# EAGLE design Processor Board (EAGLE 7.5.0)
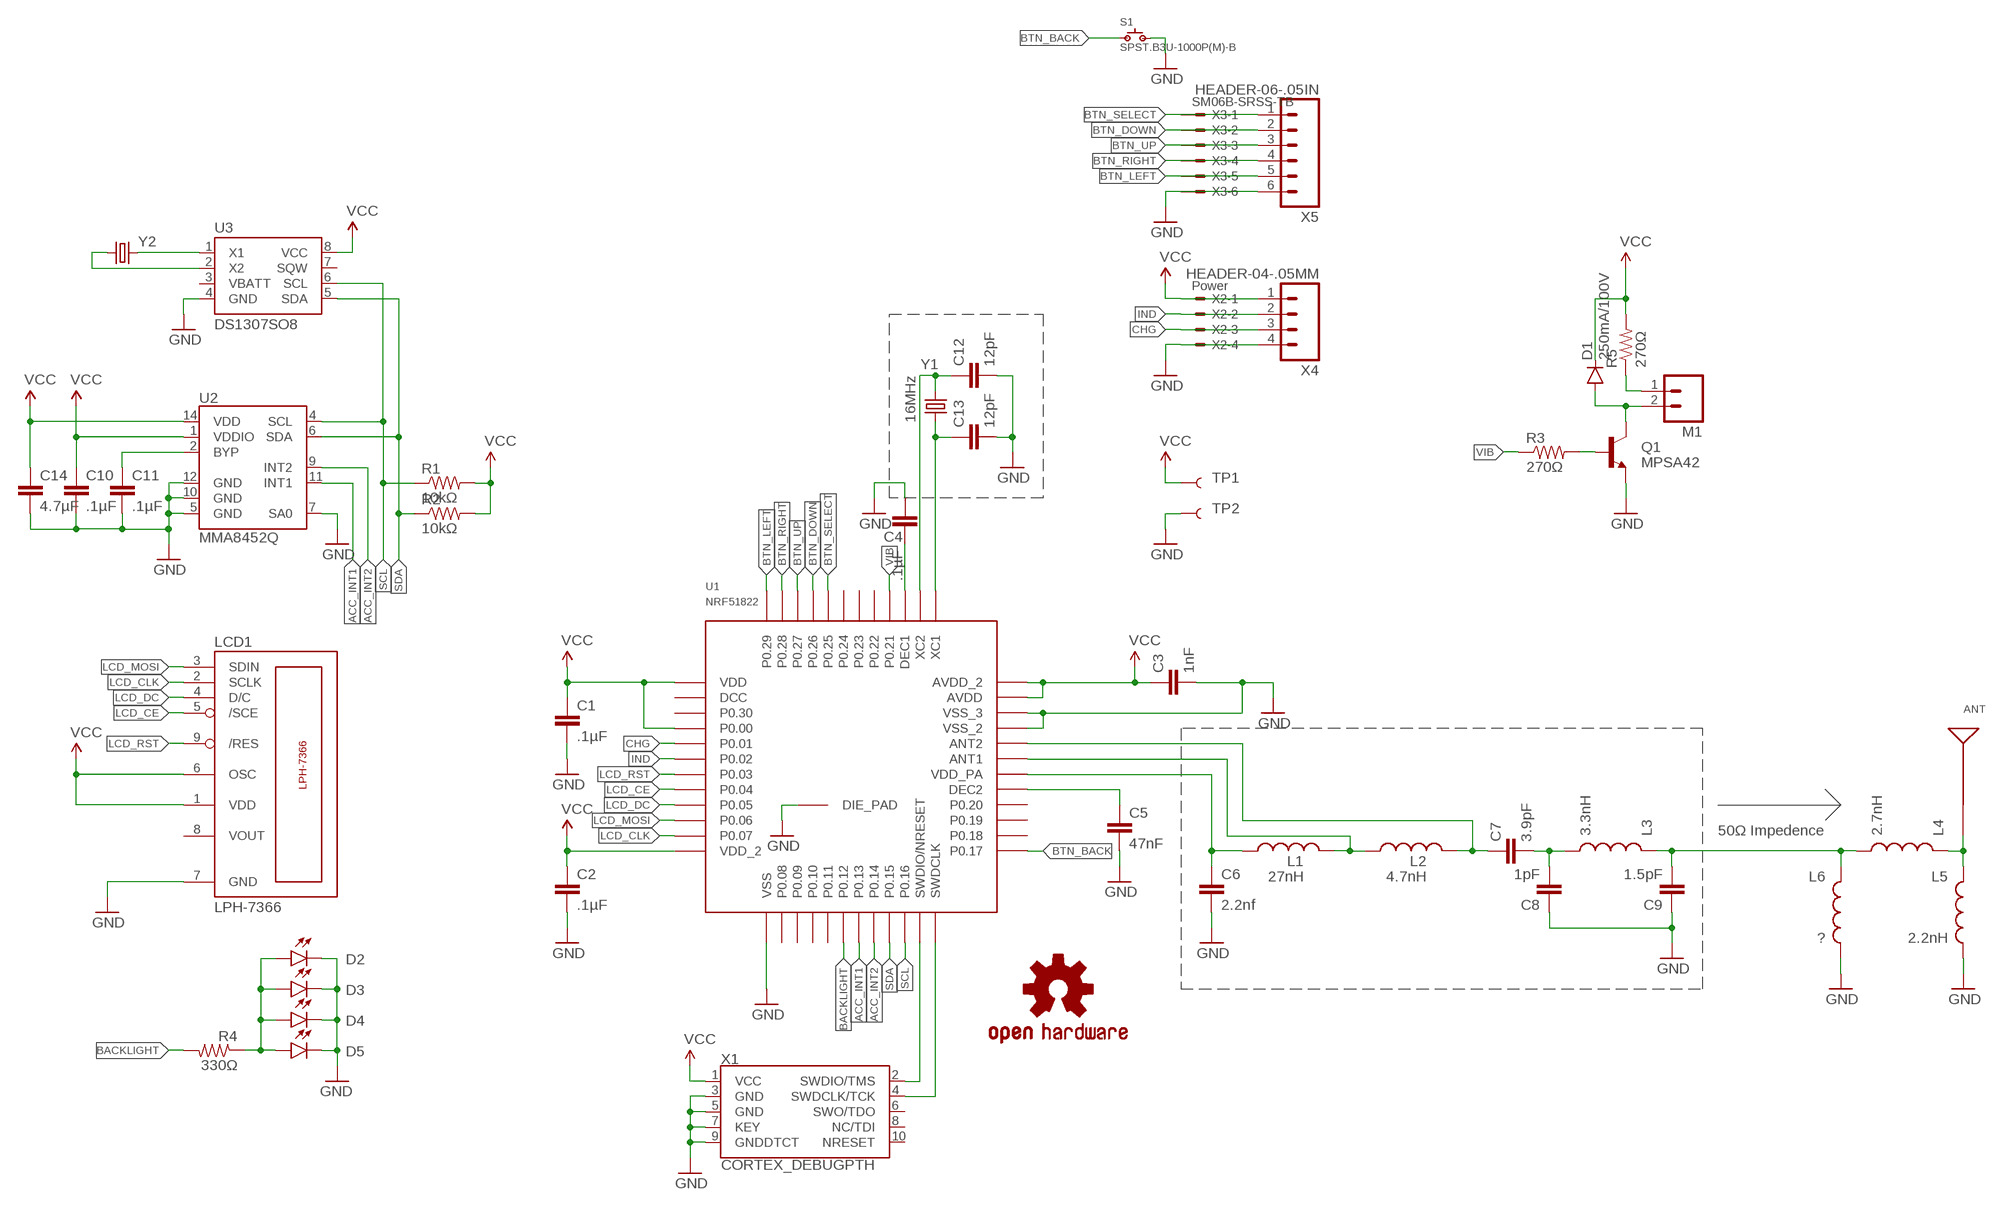
[diagram p0: schematic, sheet 1]

## Parts
ANT  ANTENNA_CHIP2450AT43B100  [AT43B]
C1  .1µF  CAP0805  [0805]
C2  .1µF  CAP0805  [0805]
C3  1nF  CAP0805  [0805]
C4  .1µF  CAP0805  [0805]
C5  47nF  CAP0805  [0805]
C6  2.2nf  CAP0805  [0805]
C7  3.9pF  CAP0805  [0805]
C8  1pF  CAP0805  [0805]
C9  1.5pF  CAP0805  [0805]
C10  .1µF  CAP0805  [0805]
C11  .1µF  CAP0805  [0805]
C12  12pF  CAP0805  [0805]
C13  12pF  CAP0805  [0805]
C14  4.7µF  CAP0805  [0805]
D1  250mA/100V  DIODEBAS16  [SOD-323]
D2  LED1206  [LED-1206]
D3  LED1206  [LED-1206]
D4  LED1206  [LED-1206]
D5  LED1206  [LED-1206]
L1  27nH  INDUCTOR0805  [0805]
L2  4.7nH  INDUCTOR0805  [0805]
L3  3.3nH  INDUCTOR0805  [0805]
L4  2.7nH  INDUCTOR0805  [0805]
L5  2.2nH  INDUCTOR0805  [0805]
L6  ?  INDUCTOR0805  [0805]
LCD1  LPH-7366  [LPH-7366]
LOGO1  OSHW-LOGOL-COPPER  [OSHW-LOGO-L_COPPER]
M1  M021X02_NO_SILK  [1X02_NO_SILK]
Q1  MPSA42  TRANSISTOR_NPNMPSA42  [SOT23-3]
R1  10kΩ  RESISTOR0805-RES  [0805]
R2  10kΩ  RESISTOR0805-RES  [0805]
R3  270Ω  RESISTOR0805-RES  [0805]
R4  330Ω  RESISTOR0805-RES  [0805]
R5  270Ω  RESISTOR0805-RES  [0805]
S1  SPST.B3U-1000P(M)-B  [B3U-1000P(M)-B]
TP1  TEST-POINT3  [PAD.03X.03]
TP2  TEST-POINT3  [PAD.03X.03]
U1  NRF51822  [QFN48]
U2  MMA8452Q  [QFN-16_0.5MM]
U3  DS1307SO8  [SO08]
X1  CORTEX_DEBUGPTH  [2X5-PTH-1.27MM]
X2  Power  SM04B-SRSS-TB  [SM04B-SRSS-TB]
X3  SM06B-SRSS-TB  [SM06B-SRSS-TB]
X4  HEADER-04-.05MM  [HEADER-04-.05IN]
X5  HEADER-06-.05IN  [HEADER-06-.05IN]
Y1  16MHz  CRYSTALCRYSTAL-SMD-5X3-16MHZ  [CRYSTAL-SMD-5X3]
Y2  CRYSTAL32-SMD-MELF  [CRYSTAL-32KHZ-SMD-MELF]

## Nets
ACC_INT1: U1.19(P0.13) U2.11(INT1)
ACC_INT2: U1.20(P0.14) U2.9(INT2)
ANT: ANT.ANT L4.1 L5.1
ANT1: L1.1 L2.2 U1.31(ANT1)
ANT2: C7.1 L2.1 U1.32(ANT2)
BACKLIGHT: R4.2 U1.18(P0.12)
BTN_BACK: S1.1 U1.25(P0.17)
BTN_DOWN: U1.45(P0.26) X3.2 X5.2
BTN_LEFT: U1.48(P0.29) X3.5 X5.5
BTN_RIGHT: U1.47(P0.28) X3.4 X5.4
BTN_SELECT: U1.44(P0.25) X3.1 X5.1
BTN_UP: U1.46(P0.27) X3.3 X5.3
CHG: U1.5(P0.01) X2.3 X4.3
F_1: C7.2 C8.2 L3.2
F_2: C9.2 L3.1 L4.2 L6.1
GND: C1.2 C2.2 C3.2 C4.1 C5.2 C6.2 C8.1 C9.1 C10.2 C11.2 C12.1 C13.1 C14.2 D2.C D3.C D4.C D5.C L5.2 L6.2 LCD1.7(GND) Q1.2(E) S1.2 TP2.P$1 U1.13(VSS) U1.33(VSS_2) U1.34(VSS_3) U1.GND(DIE_PAD) U2.5(GND) U2.7(SA0) U2.10(GND) U2.12(GND) U3.4(GND) X1.3(GND) X1.5(GND) X1.7(KEY) X1.9(GNDDTCT) X2.4 X3.6 X4.4 X5.6
IND: U1.6(P0.02) X2.2 X4.2
LCD_CE: LCD1.5(/SCE) U1.8(P0.04)
LCD_CLK: LCD1.2(SCLK) U1.11(P0.07)
LCD_DC: LCD1.4(D/C) U1.9(P0.05)
LCD_MOSI: LCD1.3(SDIN) U1.10(P0.06)
LCD_RST: LCD1.9(/RES) U1.7(P0.03)
N$1: U1.24(SWDCLK) X1.4(SWDCLK/TCK)
N$2: C4.2 U1.39(DEC1)
N$3: U1.23(SWDIO/NRESET) X1.2(SWDIO/TMS)
N$4: C5.1 U1.29(DEC2)
N$6: C11.1 U2.2(BYP)
N$10: Q1.1(B) R3.2
N$11: C12.2 U1.38(XC2) Y1.3
N$12: C13.2 U1.37(XC1) Y1.1
N$13: U3.1(X1) Y2.X2
N$14: D1.A M1.2 Q1.3(C)
N$15: M1.1 R5.1
N$16: U3.2(X2) Y2.X1
N$17: D2.A D3.A D4.A D5.A R4.1
SCL: R1.1 U1.22(P0.16) U2.4(SCL) U3.6(SCL)
SDA: R2.1 U1.21(P0.15) U2.6(SDA) U3.5(SDA)
VCC: C1.1 C2.1 C3.1 C10.1 C14.1 D1.C LCD1.1(VDD) LCD1.6(OSC) R1.2 R2.2 R5.2 TP1.P$1 U1.1(VDD) U1.4(P0.00) U1.12(VDD_2) U1.35(AVDD) U1.36(AVDD_2) U2.1(VDDIO) U2.14(VDD) U3.8(VCC) X1.1(VCC) X2.1 X4.1
VDD_PA: C6.1 L1.2 U1.30(VDD_PA)
VIB: R3.1 U1.40(P0.21)
Unconnected: LCD1.8(VOUT) U1.2(DCC) U1.3(P0.30) U1.14(P0.08) U1.15(P0.09) U1.16(P0.10) U1.17(P0.11) U1.26(P0.18) U1.27(P0.19) U1.28(P0.20) U1.41(P0.22) U1.42(P0.23) U1.43(P0.24) U3.3(VBATT) U3.7(SQW) X1.6(SWO/TDO) X1.8(NC/TDI) X1.10(NRESET)

## Notes on the sheet
- 50Ω Impedence

## Library data of the parts
ANT = _Antennas:ANTENNA_CHIP; DIGIKEY: 712-1010-1-ND; MANUFACTURER: Johanson Technology
C1-C14 = SparkFun-Passives:CAP: Capacitor Standard 0603 ceramic capacitor, and 0.1" leaded capacitor.
D1 = SparkFun-DiscreteSemi:DIODE: Diode These are standard reverse protection diodes and small signal diodes. SMA package can handle up to about 1A. SOD-323 can handle about 200mA. What the SOD-323 package when ordering, there are some mfgs out there that are 5-pin packages.; PROD_ID: DIO-09646
D2-D5 = SparkFun-LED:LED: LEDs Standard schematic elements and footprints for 5mm, 3mm, 1206, and 0603 sized LEDs. 5mm - Spark Fun Electronics SKU : COM-00529 (and others)
L1-L6 = SparkFun-Passives:INDUCTOR: Inductors Basic Inductor/Choke - 0603 and 1206. Footprints are not proven and vary greatly between part numbers. INDUCTOR POWER 3.3UH 4.0A SMD 0.197" L x 0.197" W x 0.177" H (5.00mm x 5.00mm x 4.50mm)
LCD1 = lph-7366:LPH-7366
LOGO1 = SparkFun-Aesthetics:OSHW-LOGO: Open Source Hardware Logo This logo indicates the piece of hardware it is found on incorporates a OSHW license and/or adheres to the definition of open source hardware found here: http://freedomdefined.org/OSHW
M1 = SparkFun-Connectors:M02: Standard 2-pin 0.1" header. Use with - straight break away headers ( PRT-00116) - right angle break away headers (PRT-00553) - swiss pins (PRT-00743) - machine pins (PRT-00117) - female headers (PRT-00115) Molex polarized connector foot print use with: PRT-08233 with associated crimp pins and housings. 2.54_SCREWTERM for use with PRT-10571. 3.5mm Screw Terminal footprints for PRT-08084 5mm Screw Terminal footprints for use with PRT-08432
Q1 = SparkFun-DiscreteSemi:TRANSISTOR_NPN: Generic NPN BJT MMBT2222A - TRANS-08049 (SOT-23, 1A 40V) MPSA42 - TRANS-09116 (SOT-23, 500mA 300V) MMBT5088LT1G - TRANS-11160 (SOT-23, 50 mA 30V) BC547 - COM-08928 <http://www.sparkfun.com/products/8928> (TO-92 45V 100mA) (1.Collector 2.Base 3.Emitter) 2N3904 - COM-00521 <http://www.sparkfun.com/products/521> (TO-92 40V 200mA) (1.Emitter 2.Base 3.Collector) P2N2222A - COM-12852 <http://www.sparkfun.com/products/12852> (TO-92 40V 600mA) (1.Collector 2.Base 3.Emitter); PROD_ID: TRANS-09116
R1-R5 = SparkFun-Passives:RESISTOR: Resistor Basic schematic elements and footprints for 0603, 1206, and PTH resistors.
S1 = omron:SPST
TP1 TP2 = SparkFun-Passives:TEST-POINT: Bare copper test points for troubleshooting or ICT
U1 = NordicSemi:NRF51822: Bluetooth 4.0 Low Energy/2.4Ghz NORDIC SEMICONDUCTOR
U2 = SparkFun-Sensors:MMA8452Q: MMA8452Q 3-Axis, 12/8-bit Digital Accelerometer Supply Voltage: 1.6-3.6V Range: +/- 2g, 4g, 8g Interface: I2C, 12-bit and 8-bit ODR: 1.56 Hz - 800 Hz Package: QFN-16 http://cache.freescale.com/files/sensors/doc/data_sheet/MMA8452Q.pdf; PROD_ID: IC-10769
U3 = SparkFun-FreqCtrl:DS1307: I2C real-time clock with battery backup.
X1 = SparkFun-Connectors:CORTEX_DEBUG: Cortex Debug Connector Datasheet <http://infocenter.arm.com/help/topic/com.arm.doc.faqs/attached/13634/cortex_debug_connectors.pdf>
X2 = con-jst2:?M04B-SRSS-TB: Disconnectable Crimp style connector, 1.0mm pitch 4 contacts
X3 = con-jst2:?M06B-SRSS-TB: Disconnectable Crimp style connector, 1.0mm pitch 6 contacts
X4 = _Connectors:HEADER-04: generic 4-pin connectors
X5 = _Connectors:HEADER-06: generic 6-pin headers
Y1 = SparkFun-FreqCtrl:CRYSTAL: Various standard crystals. Proven footprints.; PROD_ID: XTAL-08218
Y2 = SparkFun-FreqCtrl:CRYSTAL: Various standard crystals. Proven footprints.; PROD_ID: XTAL-07894

## Board
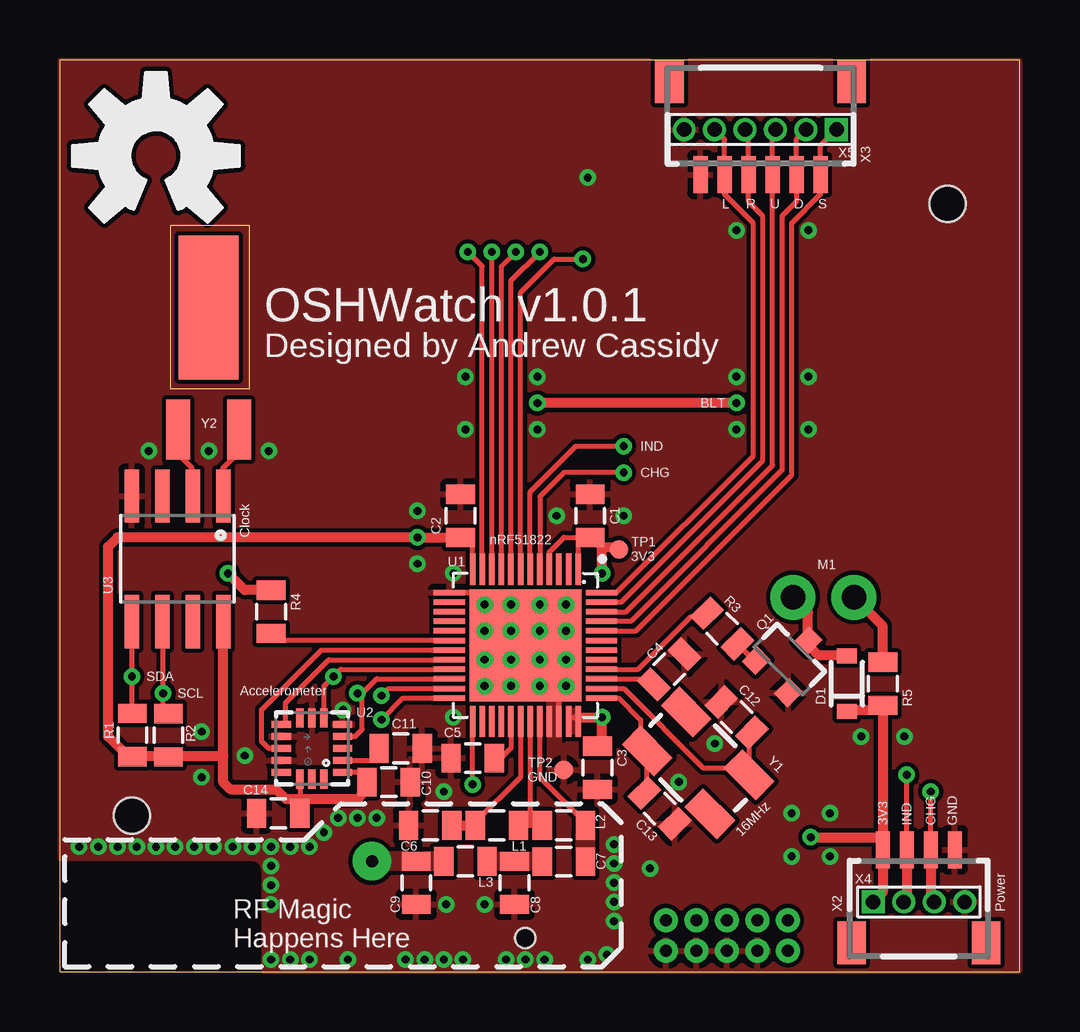
[diagram p1: board, top side]
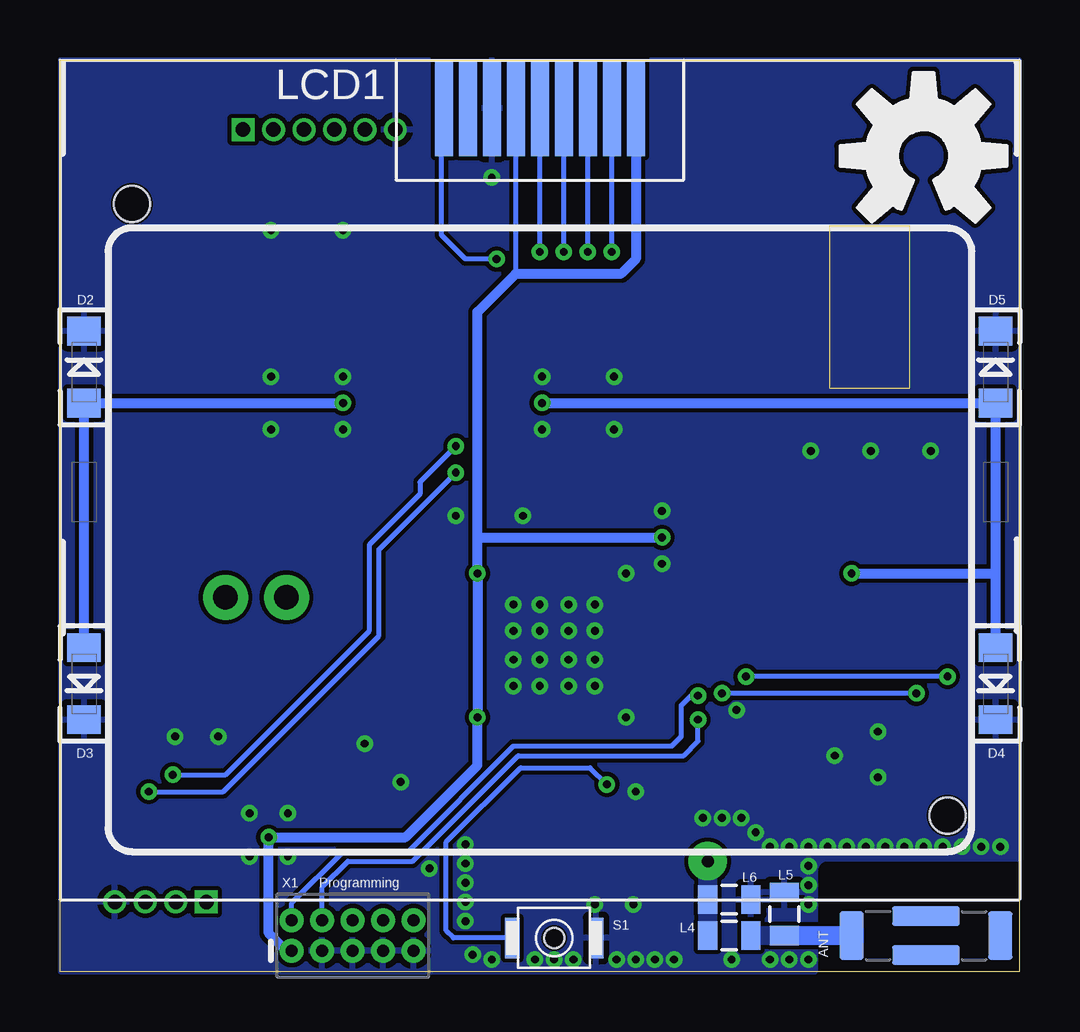
[diagram p2: board, bottom side, seen from below]

Size 40 x 38 mm. Coordinates in mm from the lower left corner, seen from the top.
Outline: 0,0 40,0 40,38 0,38 0,0
Outline: 4.6,24.3 7.9,24.3 7.9,31.1 4.6,31.1 4.6,24.3
Copper layers (1*16): Top 0.0356mm / dielectric 1.5011mm / Bottom 0.0356mm
Design rules "oshpark-2layer *": minimum track width 6mil, minimum drill 13mil, track to track 7mil, track to pad 7mil, pad to pad 6mil, via to via 7mil, smd to smd 0mil, copper to edge 0mil, drill to drill 6mil, minimum pad ring 7mil, minimum via ring 7mil, stop-mask expansion 0mil, vias tented up to drill 25mil, thermal gap 10mil

### Footprints (pad centres in the part's own frame; a part is rotated, then mirrored left to right if it is on the bottom)
AT43B = smd 1 x 2: ANT 3.1,0; NC$1 -3.1,0 | smd 2.8 x 0.8: NC$2 0,0.815; NC$3 0,-0.815
0805 = smd 0.8 x 1.2: 1 -0.9,0; 2 0.9,0
SOD-323 = smd 0.63 x 0.83: A 1.15,0; C -1.15,0
LED-1206 = smd 1.2 x 1.4: A -1.5,0; C 1.5,0
LPH-7366 = smd 0.75 x 4: 1 4,17; 2 3,17; 3 2,17; 4 1,17; 5 0,17; 6 -1,17; 7 -2,17; 8 -3,17; 9 -4,17 | hole 1.524: -17,13; 17,-12.5
1X02_NO_SILK = drill 1.016 pad 1.88: 1 0,0; 2 2.54,0
SOT23-3 = smd 0.8 x 0.9: 1 -0.95,-1; 2 0.95,-1; 3 0,1.1
B3U-1000P(M)-B = smd 0.6 x 1.7: 1 -1.75,0; 2 1.75,0 | hole 0.85: 0,0
PAD.03X.03 = smd 0.762 x 0.762: P$1 0,0
QFN48 = smd 1.3 x 0.226: 1 -3.17,2.2; 2 -3.17,1.8; 3 -3.17,1.4; 4 -3.17,1; 5 -3.17,0.6; 6 -3.17,0.2; 7 -3.17,-0.2; 8 -3.17,-0.6; 9 -3.17,-1; 10 -3.17,-1.4; 11 -3.17,-1.8; 12 -3.17,-2.2; 25 3.17,-2.2; 26 3.17,-1.8; 27 3.17,-1.4; 28 3.17,-1; 29 3.17,-0.6; 30 3.17,-0.2; 31 3.17,0.2; 32 3.17,0.6; 33 3.17,1; 34 3.17,1.4; 35 3.17,1.8; 36 3.17,2.2 | smd 0.226 x 1.3: 13 -2.2,-3.17; 14 -1.8,-3.17; 15 -1.4,-3.17; 16 -1,-3.17; 17 -0.6,-3.17; 18 -0.2,-3.17; 19 0.2,-3.17; 20 0.6,-3.17; 21 1,-3.17; 22 1.4,-3.17; 23 1.8,-3.17; 24 2.2,-3.17; 37 2.2,3.17; 38 1.8,3.17; 39 1.4,3.17; 40 1,3.17; 41 0.6,3.17; 42 0.2,3.17; 43 -0.2,3.17; 44 -0.6,3.17; 45 -1,3.17; 46 -1.4,3.17; 47 -1.8,3.17; 48 -2.2,3.17 | smd 4.66 x 4.66: GND 0,0
QFN-16_0.5MM = smd 0.8 x 0.3: 1 -1.275,1; 2 -1.275,0.5; 3 -1.275,0; 4 -1.275,-0.5; 5 -1.275,-1; 9 1.275,-1; 10 1.275,-0.5; 11 1.275,0; 12 1.275,0.5; 13 1.275,1 | smd 0.3 x 0.8: 6 -0.5,-1.275; 7 0,-1.275; 8 0.5,-1.275; 14 0.5,1.275; 15 0,1.275; 16 -0.5,1.275
SO08 = smd 0.61 x 2.21: 1 -1.905,-2.616; 2 -0.635,-2.616; 3 0.635,-2.616; 4 1.905,-2.616; 5 1.905,2.616; 6 0.635,2.616; 7 -0.635,2.616; 8 -1.905,2.616
2X5-PTH-1.27MM = drill 0.508 pad 1: 1 -2.54,-0.635; 2 -2.54,0.635; 3 -1.27,-0.635; 4 -1.27,0.635; 5 0,-0.635; 6 0,0.635; 7 1.27,-0.635; 8 1.27,0.635; 9 2.54,-0.635; 10 2.54,0.635
SM04B-SRSS-TB = smd 0.6 x 1.55: 1 -1.5,2.975; 2 -0.5,2.975; 3 0.5,2.975; 4 1.5,2.975 | smd 1.2 x 1.8: FIT@1 -2.8,-0.9; FIT@2 2.8,-0.9
SM06B-SRSS-TB = smd 0.6 x 1.55: 1 -2.5,2.975; 2 -1.5,2.975; 3 -0.5,2.975; 4 0.5,2.975; 5 1.5,2.975; 6 2.5,2.975 | smd 1.2 x 1.8: FIT@1 -3.8,-0.9; FIT@2 3.8,-0.9
HEADER-04-.05IN = drill 0.6 square: 1 0,0 | drill 0.6: 2 1.27,0; 3 2.54,0; 4 3.81,0
HEADER-06-.05IN = drill 0.6 square: 1 0,0 | drill 0.6: 2 1.27,0; 3 2.54,0; 4 3.81,0; 5 5.08,0; 6 6.35,0
CRYSTAL-SMD-5X3 = smd 1.9 x 1.1: 1 -1.85,-1.15; 2 1.85,-1.15; 3 1.85,1.15; 4 -1.85,1.15
CRYSTAL-32KHZ-SMD-MELF = smd 2.5 x 6: SHEILD 0,5.08 | smd 1 x 2.5: X1 -1.27,0; X2 1.27,0

### Placement (x,y rotation side)
ANT  3.9,1.5 180 bottom
C1  22.1,19 90 top
C2  16.7,19 90 top
C3  22.4,8.5 270 top
C4  25.4,12.6 225 top
C5  17.2,8.9 180 top
C6  15.44,6.1 180 top
C7  21,4.58 180 top
C8  18.95,3.7 90 top
C9  14.85,3.7 90 top
C10  13.7,7.9 0 top
C11  14.2,9.3 0 top
C12  28.2,10.6 315 top
C13  25,6.8 135 top
C14  9.1,6.6 180 top
D1  32.8,12 90 top
D2  39,25.2 90 bottom
D3  39,12 270 bottom
D4  1,12 270 bottom
D5  1,25.2 90 bottom
L1  18.21,6.1 180 top
L2  21,6.1 180 top
L3  16.9,4.6 0 top
L4  12.1,1.5 180 bottom
L5  9.8,2.4 90 bottom
L6  12.1,3 0 bottom
LCD1  20,19 0 bottom
LOGO1  4,34 0 top
LOGO2  OSHW-LOGOL-COPPER  [OSHW-LOGO-L_COPPER]  4,34 0 bottom
M1  33.1,15.6 180 top
Q1  30.4,13 315 top
R1  4.52,9.85 270 top
R2  3.02,9.86 270 top
R3  27.6,14.3 315 top
R4  8.8,15 270 top
R5  34.3,12 270 top
S1  19.4,1.4 0 bottom
TP1  23.3,17.6 45 top
TP2  21,8.4 0 top
U1  19.4,13.6 270 top
U2  10.5,9.3 180 top
U3  4.9,17.2 180 top
U$1  [OSHW-LOGO-L]  4,34 0 top
U$2  [OSHW-LOGO-L]  4,34 0 bottom
X1  27.8,1.5 0 bottom
X2  35.8,2.1 0 top
X3  29.2,36.2 180 top
X4  33.9,2.9 0 top
X5  32.37,35.1 180 top
Y1  26.6,8.7 315 top
Y2  6.2,22.6 0 top

### Tracks (layer width: path | path; a pad name or v marks a point on that pad's centre or on a via)
ACC_INT1
  Top 0.2: U2.11 8.7,9.3 8.4,9.6 8.4,10.9 10.9,13.4 U1.19
ACC_INT2
  Top 0.2: U2.9 9.4,10.3 9.4,11.2 11.2,13 U1.20
ANT
  Bottom 0.8: ANT.ANT L5.1
  pour Bottom (no thermals): 10.8,1.8 6.6,1.8 6.6,1.2 10.8,1.2
ANT1
  Top 0.2: U1.31 19.6,6.1
  Top 0.254: L2.2 19.6,6.1 L1.1
ANT2
  Top 0.2: U1.32 20,8.1 21.9,6.2 L2.1
  pour Top (no thermals): 22.2,5 21.6,5 21.6,5.7 22.2,5.7
BACKLIGHT
  Top 0.2: U1.18 9.1,13.8 R4.2
BTN_BACK  (via drill 0.33)
  Top 0.2: v17.2,7.8 U1.25
  Bottom 0.2: S1.1 23.6,1.4 23.9,1.7 23.9,5.4 20.8,8.5 17.9,8.5 v17.2,7.8
BTN_DOWN
  Top 0.2: U1.45 23.8,14.6 30.1,20.9 30.1,31.5 30.7,32.1 X3.2 30.7,34.7 X5.2
BTN_LEFT
  Top 0.2: U1.48 23.2,15.8 28.9,21.5 28.9,31.2 27.7,32.4 X3.5 27.7,34.69 X5.5
BTN_RIGHT
  Top 0.2: U1.47 23.4,15.4 29.3,21.3 29.3,31.5 28.7,32.1 X3.4 28.7,34.96 X5.4
BTN_SELECT
  Top 0.2: U1.44 24,14.2 30.5,20.7 30.5,31.2 31.7,32.4 X3.1 31.7,34.43 X5.1
BTN_UP
  Top 0.2: U1.46 23.6,15 29.7,21.1 X3.3 29.7,34.97 X5.3
CHG  (via drill 0.33)
  Top 0.2: X2.3 v36.3,7.5 | v23.5,20.8 21,20.8 20,19.8 U1.5
  Top 0.406: X2.3 36.3,3.04 X4.3
  Bottom 0.2: v36.3,7.5 33.2,7.5 26.7,14 26.7,17.6 v23.5,20.8
F_1
  pour Top (no thermals): 18.2,4.9 19.8,4.9 19.8,4.3 18.2,4.3
F_2  (via drill 0.5 pad 1.6)
  other vias: 13,4.6
  pour Top (no thermals): 15.2,4.3 15.8,4.3 15.8,4.9 15.2,4.9
  pour Top (no thermals): 14.5,4.9 13,4.9 arc90 12.7,4.6 arc90 13,4.3 14.5,4.3
  pour Bottom (no thermals): 12.7,4.6 arc-90 13,4.9 arc-90 13.3,4.6 13.3,1.8 12.8,1.3 12.7,1.3
GND  (via drill 0.33)
  Top 0.2: U1.34 20.8,11.6 v21.1,11.9 | U1.13 17.1,15.8
  Top 0.406: U1.GND v20,14.2
  other vias: 23.1,4.5 23.1,5.3 12.4,6.4 11.6,6.4 11,5.8 12,0.5 10.4,0.5 9.6,0.5 8.8,0.5 20,13 20,11.9 21.1,13 17.7,13 17.7,11.9 18.8,11.9 18.8,13 17.7,15.3 17.7,14.2 18.8,14.2 18.8,15.3 20,15.3 21.1,14.2 21.1,15.3 14.4,0.5 15.2,0.5 16,0.5 8,5.2 7.2,5.2 6.4,5.2 5.6,5.2 4.8,5.2 4,5.2 3.2,5.2 2.4,5.2 1.6,5.2 0.8,5.2 8.8,5.2 11.8,10.9 20.7,19 14.9,19.2 14.9,17 5.9,8.1 5.9,10 7.7,9 16.4,10.6 16.4,16.6 19.9,22.6 16.9,22.6 16.9,24.8 19.9,24.8 28.2,24.8 22,33.1 6.2,21.7 27.3,9.5 25.8,7.9 23.5,19 3.7,21.7 8.7,21.7 9.6,5.2 10.4,5.2 16,7.5 13.2,6.4 23.1,3.7 23.1,2.9 23.1,2.1 18.6,0.5 19.4,0.5 20.2,0.5 22,0.5 22.8,0.7 16.1,2.8 17.7,2.8 8.8,4.4 16.8,0.5 8.8,3.6 8.8,2.8 24.6,4.3 30.5,4.8 32.1,4.8 30.5,6.6 32.1,6.6 33.4,9.8 35.2,9.8 28.2,22.6 31.2,24.8 31.2,22.6 28.2,30.9 31.2,30.9
  pour Top (rank 2): 0,4.7 0,38 40,38 40,0 8.5,0 8.5,4.2 arc90 8,4.7
  pour Bottom (isolate 0.1, rank 2): 0,4.7 0,38 40,38 40,0 8.5,0 8.5,4.2 arc90 8,4.7
  pour Top (no thermals): 20.4,11.5 20.8,11.5 20.8,9.3 20.4,9.3
IND  (via drill 0.33)
  Top 0.2: X2.2 v35.3,8.2 | U1.6 19.6,20 21.5,21.9 v23.5,21.9
  Top 0.406: X2.2 35.3,3.03 X4.2
  Bottom 0.2: v35.3,8.2 33.1,8.2 27.1,14.2 27.1,17.8 25,19.9 25,20.4 v23.5,21.9
LCD_CE  (via drill 0.33)
  Top 0.2: U1.8 18.8,28.8 v20,30
  Bottom 0.2: v20,30 LCD1.5
LCD_CLK  (via drill 0.33)
  Top 0.2: U1.11 17.6,29.4 v17,30
  Bottom 0.2: v17,30 LCD1.2
LCD_DC  (via drill 0.33)
  Top 0.2: U1.9 18.4,29.4 v19,30
  Bottom 0.2: v19,30 LCD1.4
LCD_MOSI  (via drill 0.33)
  Top 0.2: U1.10 v18,30
  Bottom 0.2: v18,30 LCD1.3
LCD_RST  (via drill 0.33)
  Top 0.2: U1.7 19.2,28.3 20.6,29.7 v21.8,29.7
  Bottom 0.2: v21.8,29.7 23.1,29.7 24.1,30.7 24.1,35.9 LCD1.9
N$1  (via drill 0.33)
  Top 0.2: v13.4,10.5 14.3,11.4 U1.24
  Bottom 0.2: X1.4 29.07,3.53 28,4.6 25.3,4.6 20.9,9 14,9 13.4,9.6 v13.4,10.5
N$2
  Top 0.2: U1.39 24.53,12.2 C4.2
N$3  (via drill 0.33)
  Top 0.2: v13.4,11.5 13.7,11.8 U1.23
  Bottom 0.2: X1.2 30.34,2.86 28.2,5 25.5,5 21.1,9.4 14.5,9.4 14.1,9.8 14.1,11.1 13.7,11.5 v13.4,11.5
N$4
  Top 0.2: U1.29 18.8,9.31 18.41,8.93
  Top 0.254: 18.41,8.93 C5.1
N$6
  Top 0.2: U2.2 13.3,8.8 C11.1
N$10
  Top 0.2: Q1.1 28.93,12.96 R3.2
N$11
  Top 0.2: U1.38 23.5,11.8 26.8,8.5 28.4,8.5 Y1.3 28.72,9.85 C12.2
N$12
  Top 0.2: U1.37 23.3,11.4 24.2,10.5 24.2,9.72 24.08,9.6 24.2,9.6 24.48,9.32 Y1.1 24.48,7.55 C13.2
N$13
  Top 0.2: Y2.X2 7.5,22.6 7.5,21.7 6.8,21 6.8,19.9 U3.1
N$14
  Top 0.406: M1.2 31.18,14.98 Q1.3 31.2,13.6 31.6,13.2 32.8,13.2 D1.A
N$15
  Top 0.406: R5.1 34.3,14.4 M1.1
N$16
  Top 0.2: Y2.X1 4.9,22.6 4.9,21.6 5.5,21 5.5,19.9 U3.2
N$17  (via drill 0.33)
  Top 0.406: v28.2,23.7 v19.9,23.7 | R4.1 7.7,15.9 v7,16.6
  Bottom 0.406: D4.A 1,16.6 | 1,16.6 D5.A v19.9,23.7 | D3.A D2.A v28.2,23.7 | v7,16.6 1,16.6
SCL  (via drill 0.33)
  Top 0.2: 12.6,11.6 13.2,12.2 U1.22 | U2.4 12.3,9.8 12.6,10.1 12.6,11.6 | v12.4,11.6 12.6,11.6 | U3.6 4.3,14.55 v4.3,11.6 4.3,10.97 R1.1
  Bottom 0.2: v4.3,11.6 v12.4,11.6
SDA  (via drill 0.33, 0.33 pad 0.43)
  Top 0.2: U1.21 11.7,12.6 v11.4,12.3 11,11.9 U2.6 | U3.5 3,14.5 v3,12.3 3,10.78 R2.1
  Bottom 0.2: v3,12.3 v11.4,12.3
VCC  (via drill 0.33)
  Top 0.2: 21.9,18.1 21.6,17.8 U1.1 | U2.14 C14.1 | U2.1 12.6,8.3 12.8,8.3 C10.1 | U1.12 17.2,18.1 C2.1 | C1.1 21,18.1 20.4,17.5 U1.4 | 23.2,17.7 TP1.P$1 | U1.36 21.6,10.6 21.2,10.6 U1.35
  Top 0.254: C1.1 21.9,18.1 | C3.1 22.6,9.6
  Top 0.406: 22.6,9.6 v22.6,10.6 21.6,10.6 | v31.3,5.6 34.3,5.6 X2.1 | 10,7.2 9.4,7.2 9,7.6 7.1,7.6 6.8,7.89 6.8,9 | C14.1 10,7.2 | 10,7.2 12.4,7.2 12.6,7.4 12.6,8.3 | v22.6,16.6 22.6,17.7 | 22.6,17.7 22.2,18.1 C1.1 | C2.1 v14.9,18.1 2.4,18.1 2,17.7 2,9.8 2.84,8.96 R2.2 | X2.1 R5.2 34.1,10.9 32.8,10.9 D1.C | 2.98,9 R2.2 | 6.8,9 U3.8 | 22.6,17.7 23.2,17.7 | R2.2 3.08,9 4.57,9 | R1.2 4.57,9 | 4.57,9 6.8,9 | X2.1 34.3,3.3 X4.1
  Bottom 0.2: 21,29.1 LCD1.6
  Bottom 0.406: X1.1 30.57,0.86 31.3,1.6 v31.3,5.6 25.6,5.6 22.6,8.6 v22.6,10.6 v22.6,16.6 22.6,18.1 | LCD1.1 16,29.7 16.6,29.1 21,29.1 22.6,27.5 22.6,18.1 | 22.6,18.1 v14.9,18.1
  pour Top (no thermals): 21.2,10.9 21.6,10.9 21.6,10 21.2,10
VDD_PA
  Top 0.2: U1.30 19.2,8.1 17.31,6.21 L1.2
  Top 0.406: C6.1 L1.2
VIB
  Top 0.2: U1.40 24.1,12.6 26.3,14.8 26.8,14.8 26.9,14.9 R3.1

### Text on the board
tPlace: L | R | U | D | S | OSHWatch v1.0.1 | Designed by Andrew Cassidy | BLT | IND | CHG | Clock | nRF51822 | TP1 / 3V3 | SDA | Accelerometer | SCL | TP2 / GND | 16MHz | 3V3 | IND | CHG | GND | Power | RF Magic / Happens Here
bPlace: Programming